# Altium schematic sheet MCU.SchDoc
size A; SheetNumber: 5; SheetTotal: 7
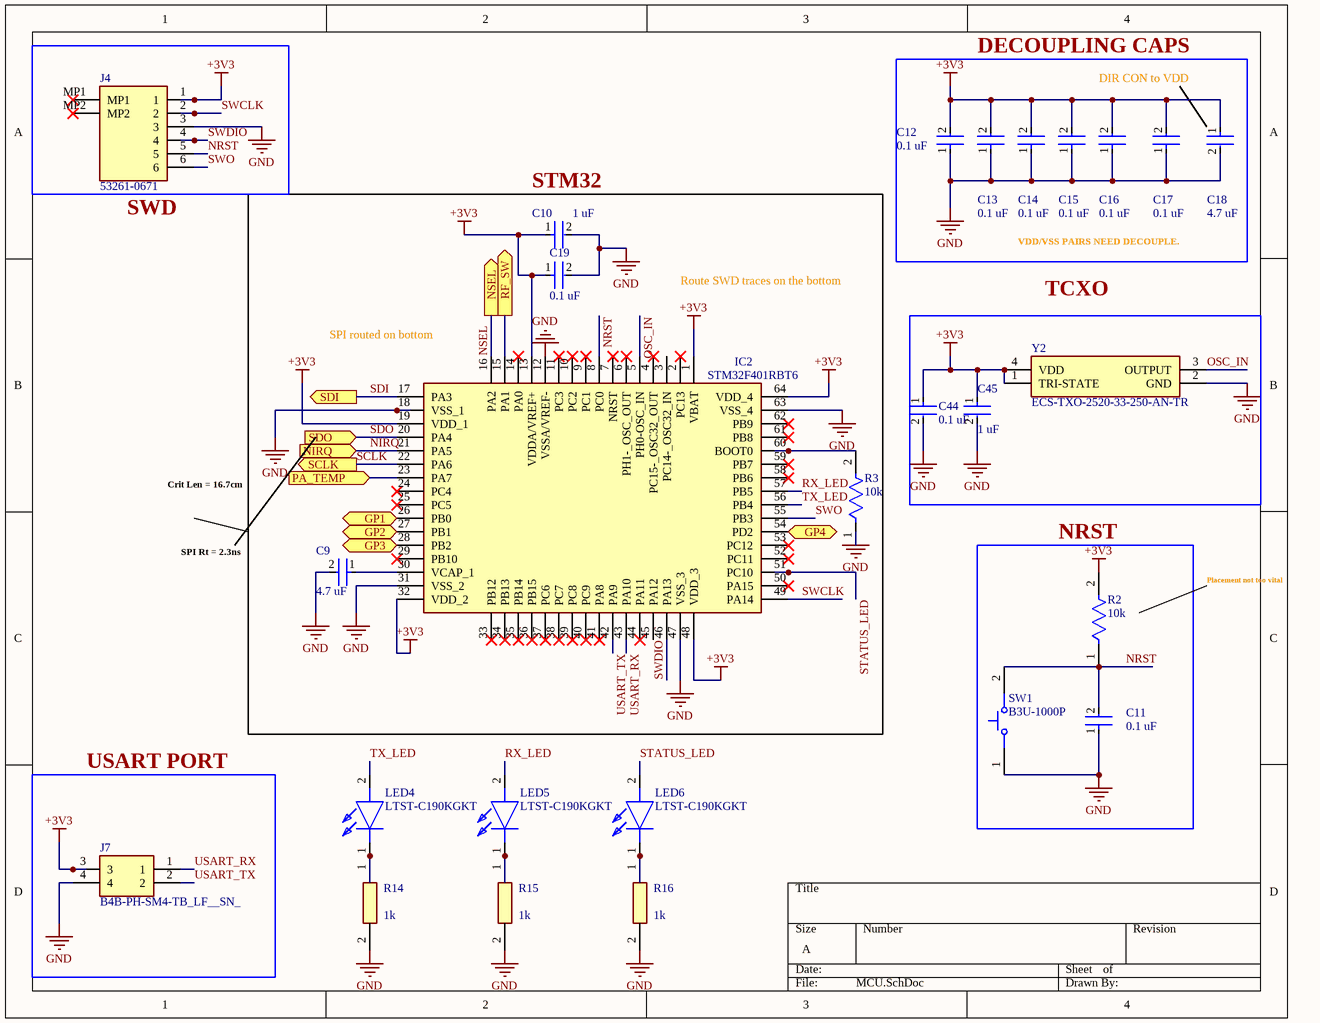
[diagram p0: MCU.SchDoc]

## Parts
C9  4.7 uF  [FP-GRM188-0_15-IPC_C]
C10  1 uF  [FP-C0402C105K9PACTU-MFG]
C11  0.1 uF  [FP-GRM033-0_03-MFG]
C12  0.1 uF  [FP-GRM033-0_03-MFG]
C13  0.1 uF  [FP-GRM033-0_03-MFG]
C14  0.1 uF  [FP-GRM033-0_03-MFG]
C15  0.1 uF  [FP-GRM033-0_03-MFG]
C16  0.1 uF  [FP-GRM033-0_03-MFG]
C17  0.1 uF  [FP-GRM033-0_03-MFG]
C18  4.7 uF  [FP-GRM188-0_15-IPC_C]
C19  0.1 uF  [FP-GRM033-0_03-MFG]
C44  0.1 uF  [FP-GRM033-0_03-MFG]
C45  1 uF  [FP-C0402C105K9PACTU-MFG]
IC2  STM32F401RBT6  [QFP50P1200X1200X160-64N]
J4  53261-0671  [532610671]
J7  B4B-PH-SM4-TB_LF__SN_  [B4B-PH-SM4_1]
LED4  LTST-C190KGKT  [LEDC1608X80N]
LED5  LTST-C190KGKT  [LEDC1608X80N]
LED6  LTST-C190KGKT  [LEDC1608X80N]
R2  10k  [FP-RMCF0402-IPC_C]
R3  10k  [FP-RMCF0402-IPC_C]
R14  1k  [RESC1608X55N]
R15  1k  [RESC1608X55N]
R16  1k  [RESC1608X55N]
SW1  B3U-1000P  [OMRON-B3U-1000_V]
Y2  ECS-TXO-2520-33-250-AN-TR  [ECSTXO252033250ANTR]

## Blocks framed on the sheet
DECOUPLING CAPS: C12-C18
STM32: C9 C10 C19 IC2 R3
TCXO: C44 C45 Y2
NRST: C11 R2 SW1
USART PORT: J7

## Ports
GP1 (bidir, see Overview[1B], si4463[3A]), GP2 (bidir, see Overview[1B], si4463[3A]), GP3 (bidir, see Overview[1B], si4463[3B]), GP4 (bidir, see Overview[1B], si4463[3B]), NIRQ (in, see Overview[1B], si4463[3A]), NSEL (out, see Overview[1B], si4463[3B]), PA_TEMP (in, see Overview[1B], LPF_PA[1C]), RF_SW (out, see Overview[1B], SW_ANT[3C]), SCLK (out, see Overview[1B], si4463[3A]), SDI (out, see Overview[1B], si4463[3B]), SDO (in, see Overview[1B], si4463[3A])

## Nets
+3V3: C10.1 C12.2 C13.2 C14.2 C15.2 C16.2 C17.2 C18.1 C19.1 C44.1 C45.1 IC2.1(VBAT) IC2.13(VDDA/VREF+) IC2.19(VDD_1) IC2.32(VDD_2) IC2.48(VDD_3) IC2.64(VDD_4) J4.1 J7.3 R2.2 Y2.1(TRI-STATE) Y2.4(VDD)
GND: C9.2 C10.2 C11.1 C12.1 C13.1 C14.1 C15.1 C16.1 C17.1 C18.2 C19.2 C44.2 C45.2 IC2.12(VSSA/VREF-) IC2.18(VSS_1) IC2.31(VSS_2) IC2.47(VSS_3) IC2.63(VSS_4) J4.3 J7.4 R3.1 R14.2 R15.2 R16.2 SW1.1 Y2.2(GND)
GP1: IC2.26(PB0) ; port GP1
GP2: IC2.27(PB1) ; port GP2
GP3: IC2.28(PB2) ; port GP3
GP4: IC2.54(PD2) ; port GP4
NIRQ: IC2.21(PA5) ; port NIRQ
NRST: C11.2 IC2.8(PC0) J4.5 R2.1 SW1.2
NSEL: IC2.16(PA2) ; port NSEL
OSC_IN: IC2.5(PH0-OSC_IN) Y2.3(OUTPUT)
PA_TEMP: IC2.23(PA7) ; port PA_TEMP
RF_SW: IC2.15(PA1) ; port RF_SW
RX_LED: IC2.57(PB5) LED5.2(A)
SCLK: IC2.22(PA6) ; port SCLK
SDI: IC2.17(PA3) ; port SDI
SDO: IC2.20(PA4) ; port SDO
STATUS_LED: IC2.51(PC10) LED6.2(A)
SWCLK: IC2.49(PA14) J4.2
SWDIO: IC2.46(PA13) J4.4
SWO: IC2.55(PB3) J4.6
TX_LED: IC2.56(PB4) LED4.2(A)
USART_RX: IC2.43(PA10) J7.1
USART_TX: IC2.42(PA9) J7.2
NetC9_1: C9.1 IC2.30(VCAP_1)
NetIC2_60: IC2.60(BOOT0) R3.2
NetLED4_1: LED4.1(K) R14.1
NetLED5_1: LED5.1(K) R15.1
NetLED6_1: LED6.1(K) R16.1

Not connected (* = marked no-connect by the designer): IC2 2(PC13)* 3(PC14-_OSC32_IN) 4(PC15-_OSC32_OUT)* 6(PH1-_OSC_OUT)* 7(NRST)* 9(PC1)* 10(PC2)* 11(PC3)* 14(PA0)* 24(PC4)* 25(PC5)* 29(PB10)* 33(PB12)* 34(PB13)* 35(PB14)* 36(PB15)* 37(PC6)* 38(PC7)* 39(PC8)* 40(PC9)* 41(PA8)* 44(PA11)* 45(PA12) 50(PA15)* 52(PC11)* 53(PC12)* 58(PB6)* 59(PB7)* 61(PB8)* 62(PB9)*; J4 MP1* MP2*

## Notes on the sheet
- DIR CON to VDD
- (near J4) SWD
- Route SWD traces on the bottom
- VDD/VSS PAIRS NEED DECOUPLE.
- (near IC2) SPI routed on bottom
- Crit Len = 16.7cm
- SPI Rt = 2.3ns
- Placement not too vital

## Library data of the parts
C9 C18 = CMP-2006-02523-2: Chip Multilayer Ceramic Capacitors for General Purpose, 0603, 4.7uF, X5R, 15%, 10%, 25V Name: GRM188R61E475KE11D; Case Code (Metric): 1608; Max Operating Temperature: 85°C; REACH SVHC: No SVHC; Voltage Rating: 25V; Dielectric: X5R; Packaging: Cut Tape; Width: 0.031inch; Min Operating Temperature: -55°C; Lead Free: Lead Free; Capacitance: 4.7uF; Height: 0.8mm; Case Code (Imperial): 0603; Length: 1.6mm; Voltage Rating (DC): 25V; Case/Package: 0603; Voltage: 25V; Tolerance: 10%; Thickness: 0.031inch; Mount: Surface Mount; Material: Ceramic; Package Quantity: 4000; Depth: 0.8mm
C10 C45 = CMP-2008-02075-2: CAP CER 1UF 6.3V X5R 0402 Name: C0402C105K9PACTU; Tolerance: 10%; Dielectric Material: Ceramic; Series: C; Lead Free: Lead Free; Min Operating Temperature: -55°C; Capacitance: 1uF; Voltage Rating (DC): 6.3V; Number of Pins: 2; REACH SVHC: No SVHC; Mount: Surface Mount; Lead Pitch: 0.3mm; Case Code (Imperial): 0402; RoHS Compliant: Yes; Radiation Hardening: No; Construction: Flat; Depth: 0.5mm; Case/Package: 0402; Termination: SMD/SMT; Height: 0.5mm; Thickness: 0.022inch; Voltage: 6.3V; Dielectric: X5R; Width: 0.02inch; Voltage Rating: 6.3V; Max Operating Temperature: 85°C; Packaging: Tape and Reel; Package Quantity: 1; Length: 1mm
C11-C17 C19 C44 = CMP-06035-019037-1: Chip Multilayer Ceramic Capacitors for General Purpose, 0201, 0.10uF, X7S, 22%, 10%, 16V Name: GRM033C71C104KE14D; Capacitance: 100nF; Dielectric: X7S; Tolerance: 10%; Voltage Rating (DC): 16V; Height: 0.3mm; Max Operating Temperature: 125°C; Case Code (Metric): 0603; Termination: SMD/SMT; Min Operating Temperature: -55°C; Mount: Surface Mount; Case/Package: 0201; Weight: 1.2E-05oz; Package Quantity: 15000; Length: 0.024inch; Voltage Rating: 16V; Case Code (Imperial): 0201; Packaging: Tape and Reel; Thickness: 0.013inch; Width: 0.3mm
IC2 = STM32F401RBT6: Integrated Circuit; Manufacturer_Name: STMicroelectronics; Datasheet Link: https://www.st.com/resource/en/datasheet/stm32f401cb.pdf; Height: 1.6mm; Manufacturer_Part_Number: STM32F401RBT6; Mouser Part Number: 511-STM32F401RBT6; Mouser Price/Stock: https://www.mouser.co.uk/ProductDetail/STMicroelectronics/STM32F401RBT6?qs=4ccVDqXDOrn4COlKBEB%252BDA%3D%3D; Arrow Part Number: STM32F401RBT6; Arrow Price/Stock: https://www.arrow.com/en/products/stm32f401rbt6/stmicroelectronics?region=europe
J4 = 53261-0671: Connector; Manufacturer_Name: Molex; Datasheet Link: https://www.molex.com/pdm_docs/sd/532610671_sd.pdf; Height: 3.6mm; Manufacturer_Part_Number: 53261-0671; Mouser Part Number: 538-53261-0671; Mouser Price/Stock: https://www.mouser.co.uk/ProductDetail/Molex/53261-0671?qs=%252B72YyncTwW9Wyr77z4J2cA%3D%3D; Arrow Part Number: 53261-0671; Arrow Price/Stock: https://www.arrow.com/en/products/53261-0671/molex?region=nac
J7 = B4B-PH-SM4-TB_LF__SN_: Connector; Manufacturer_Name: JST (JAPAN SOLDERLESS TERMINALS); Manufacturer_Part_Number: B4B-PH-SM4-TB(LF)(SN); Datasheet Link: https://datasheet.datasheetarchive.com/originals/distributors/Datasheets_SAMA/75c02eb1799788a6b14d7c521ee36df4.pdf; Mouser Part Number: N/A; Mouser Price/Stock: https://www.mouser.co.uk/ProductDetail/JST-Commercial/B4B-PH-SM4-TBLFSN?qs=QpmGXVUTftEshE2WNd%252BKhA%3D%3D; Arrow Part Number: B4B-PH-SM4-TB(LF)(SN); Arrow Price/Stock: https://www.arrow.com/en/products/b4b-ph-sm4-tb-lf-sn/jst-manufacturing?utm_currency=USD&region=europe
LED4-LED6 = LTST-C190KGKT: LED; Manufacturer_Name: Lite-On; Datasheet Link: http://uk.rs-online.com/web/p/visible-leds/6920988/; Height: 0.8mm; Manufacturer_Part_Number: LTST-C190KGKT; Mouser Part Number: 859-LTST-C190KGKT; Mouser Price/Stock: https://www.mouser.co.uk/ProductDetail/Lite-On/LTST-C190KGKT?qs=205qCy6M2Q%252BAdcgwUZktqw%3D%3D; Arrow Part Number: LTST-C190KGKT; Arrow Price/Stock: https://www.arrow.com/en/products/ltst-c190kgkt/lite-on-technology?utm_currency=USD&region=nac
R2 R3 = CMP-26527-000128-1: 10kΩ ±1% 0.063W 0402 Thick Film Chip Resistor AEC-Q200 compliant Name: RMCF0402FT10K0; Temperature Coefficient: 100ppm/°C; Power Rating: 62.5mW; Resistance: 10kR; Max Power Dissipation: 63mW; Width: 0.02inch; Case/Package: 0402; Depth: 0.5mm; Resistor Type: Thick Film; Series: RMCF; Length: 1mm; Contact Plating: Tin; Tolerance: 1%; Number of Terminations: 2; Height: 0.016inch; Military Standard: Not; Case Code (Imperial): 0402; Size Code: 0402; Construction: Rectangular; Radiation Hardening: No; RoHS Compliant: Yes; Case Code (Metric): 1005; Packaging: Tape and Reel; Lead Free: Lead Free; Min Operating Temperature: -55°C; Max Operating Temperature: 155°C; Mount: Surface Mount; Features: Automotive AEC-Q200
R14-R16 = RC0603FR-131KL: Manufacturer_Name: Yageo Group; Datasheet Link: http://www.yageo.com/documents/recent/PYu-RC0603_51_RoHS_L_v5.pdf; Height: 0.55mm; Manufacturer_Part_Number: RC0603FR-131KL; Mouser Part Number: 603-RC0603FR-131KL; Mouser Price/Stock: https://www.mouser.co.uk/ProductDetail/Yageo/RC0603FR-131KL?qs=EiqXWrxQq60RfsVJHVHHSQ%3D%3D; Arrow Part Number: RC0603FR-131KL; Arrow Price/Stock: https://www.arrow.com/en/products/rc0603fr-131kl/yageo
SW1 = CMP-011-00000-2: Tactile Switch, SPST-NO, 0.05 A, 12 V, -25 to 70 degC, 2-Pin SMD, RoHS, Tape and Reel; Manufacturer: Omron Electronic Components; IP Rating: IP40; Current Rating: 50mA; Max Contact Resistance: 100mohm; Operating Force: 153gf; Throw Configuration: SPST; Resistance: 0.1Ohm; Max Voltage Rating (DC): 12V; Contact Material: Silver; Max Current Rating: 50mA; Datasheet URL: http://www.omron.com/ecb/products/pdf/en-b3u.pdf; Mounting Technology: SM; Case/Package: B3U-1000; Packaging: TapeandReel; Package Reference: B3U-1000; Manufacturer URL: http://www.omron.com/; Datasheet Version: Jan-15; RoHS Compliant: True; Max Operating Temperature: 70°C; Contact Current Rating: 50mA; Package Quantity: 3500; Package Description: 2-Pin Surface Mount Device, Body 3 x 2.5 mm; Voltage Rating (DC): 12V; Min Operating Temperature: -25°C; Voltage Rating: 12V
Y2 = ECS-TXO-2520-33-250-AN-TR: Crystal or Oscillator; Manufacturer_Name: ECS; Datasheet Link: https://ecsxtal.com/store/pdf/ECS-TXO-2520.pdf; Height: 1mm; Manufacturer_Part_Number: ECS-TXO-2520-33-250-AN-TR; Mouser Part Number: 520-T2520-33-250-ANT; Mouser Price/Stock: https://www.mouser.co.uk/ProductDetail/ECS/ECS-TXO-2520-33-250-AN-TR?qs=KAq9QXcE8HCY8Xed3s4jaA%3D%3D; Arrow Part Number: ECS-TXO-2520-33-250-AN-TR; Arrow Price/Stock: https://www.arrow.com/en/products/ecs-txo-2520-33-250-an-tr/ecs-international